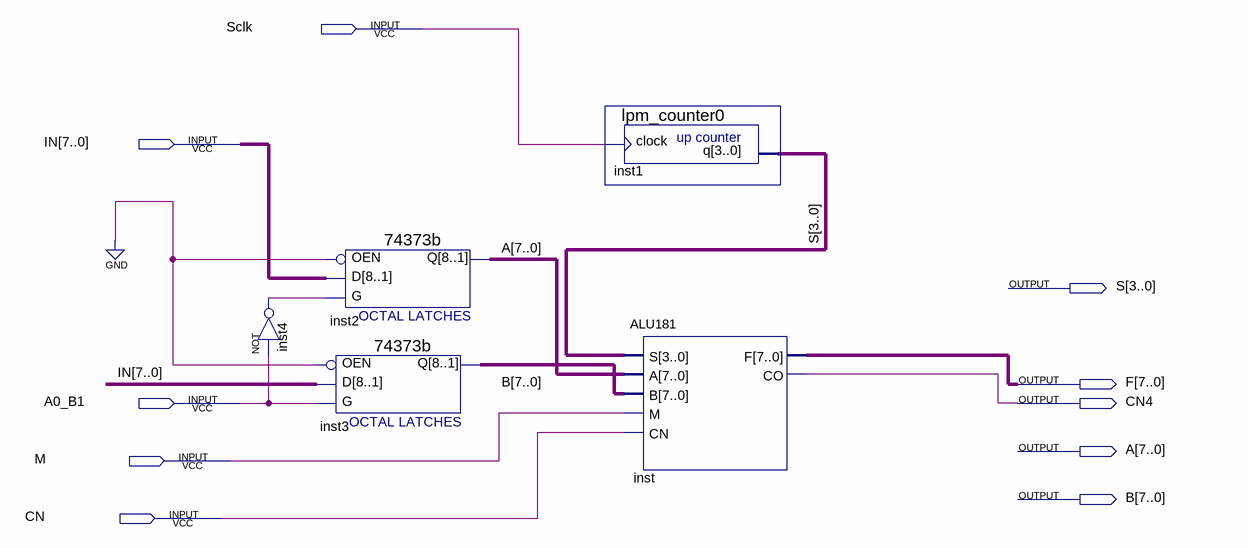
[diagram p0: schematic sheet]
// Quartus schematic ALU.bdf as structural Verilog: 5 symbols, 10 pins
module ALU (
  input  Sclk,
  input  [7:0] IN,
  input  A0_B1,
  input  M,
  input  CN,
  output [3:0] S,
  output [7:0] F,
  output CN4,
  output [7:0] A,
  output [7:0] B
);

  wire inst4_out;

  not inst4 (inst4_out, A0_B1);
  \74373b  inst2 (.D(IN), .G(inst4_out), .OEN(1'b0), .Q(A));
  \74373b  inst3 (.D(IN), .G(A0_B1), .OEN(1'b0), .Q(B));
  lpm_counter0 inst1 (.clock(Sclk), .q(S));
  ALU181 inst (.S(S), .A(A), .B(B), .M(M), .CN(CN), .F(F), .CO(CN4));
endmodule
